# Altium schematic sheet Turtlelogger.SchDoc
size 299 x 100 mm
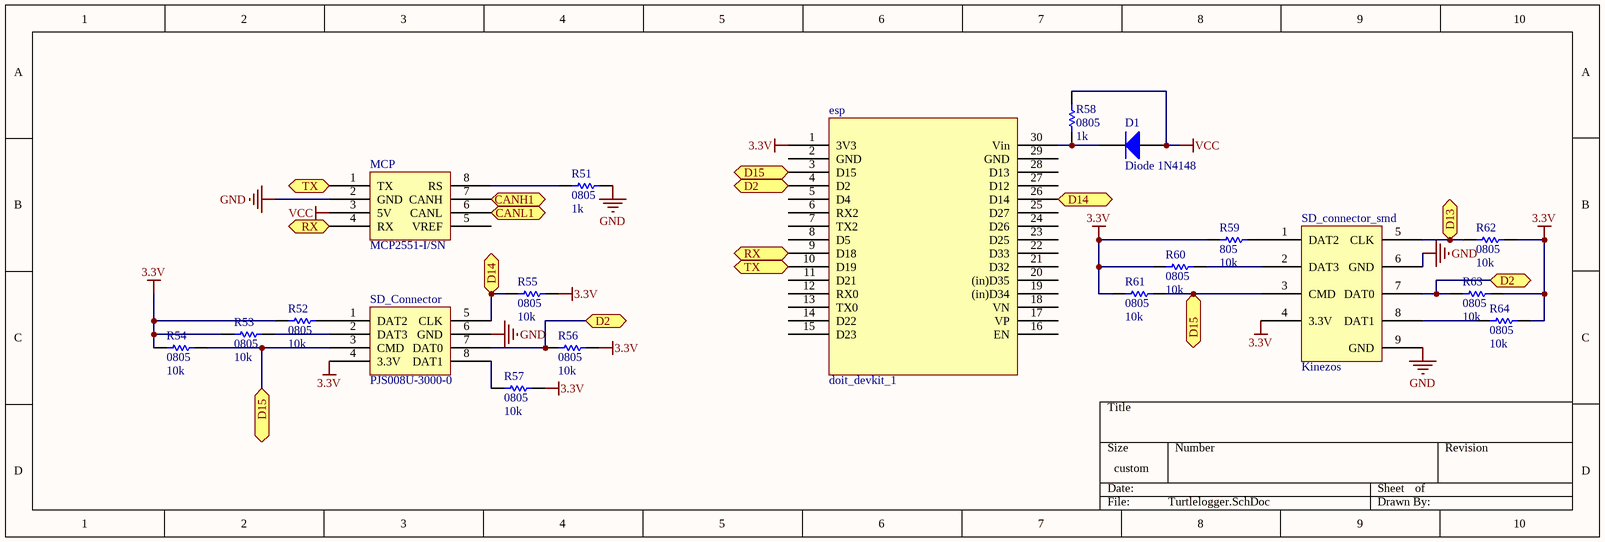
[diagram p0: Turtlelogger.SchDoc]

## Parts
D1  Diode 1N4148  [DO-35]
esp  doit_devkit_1  [PCBComponent_1]
MCP  MCP2551-I/SN  [SOIC127P600X175-8N]
R51  0805  value 1k  [RESC2012X06N]
R52  0805  value 10k  [RESC2012X06N]
R53  0805  value 10k  [RESC2012X06N]
R54  0805  value 10k  [RESC2012X06N]
R55  0805  value 10k  [RESC2012X06N]
R56  0805  value 10k  [RESC2012X06N]
R57  0805  value 10k  [RESC2012X06N]
R58  0805  value 1k  [RESC2012X06N]
R59  805  value 10k  [RESC2012X06N]
R60  0805  value 10k  [RESC2012X06N]
R61  0805  value 10k  [RESC2012X06N]
R62  0805  value 10k  [RESC2012X06N]
R63  0805  value 10k  [RESC2012X06N]
R64  0805  value 10k  [RESC2012X06N]
SD_Connector  PJS008U-3000-0  [PCBComponent_1]
SD_connector_smd  Kinezos  [PCBComponent_1]

## Ports
CANH1, CANL1, D2, D13, D14, D15, RX, TX

## Nets
3.3V: esp.1(3V3) R52.2 R53.2 R54.2 R55.1 R56.1 R57.1 R59.2 R60.2 R61.2 R62.1 R63.1 R64.1 SD_Connector.4(3.3V) SD_connector_smd.4(3.3V)
GND: MCP.2(GND) R51.1 SD_Connector.6(GND) SD_connector_smd.6(GND) SD_connector_smd.9(GND)
VCC: D1.1(A) MCP.3(5V) R58.1
CANH1: MCP.7(CANH) ; port CANH1
CANL1: MCP.6(CANL) ; port CANL1
D2: esp.4(D2) R56.2 R63.2 SD_Connector.7(DAT0) SD_connector_smd.7(DAT0) ; port D2
D13: R62.2 SD_connector_smd.5(CLK) ; port D13
D14: esp.26(D14) R55.2 SD_Connector.5(CLK) ; port D14
D15: esp.3(D15) R54.1 R61.1 SD_Connector.3(CMD) SD_connector_smd.3(CMD) ; port D15
RX: esp.9(D18) MCP.4(RX) ; port RX
TX: esp.10(D19) MCP.1(TX) ; port TX
NetD1_2: D1.2(K) esp.30(Vin) R58.2
NetMCP_8: MCP.8(RS) R51.2
NetR52_1: R52.1 SD_Connector.1(DAT2)
NetR53_1: R53.1 SD_Connector.2(DAT3)
NetR57_2: R57.2 SD_Connector.8(DAT1)
NetR59_1: R59.1 SD_connector_smd.1(DAT2)
NetR60_1: R60.1 SD_connector_smd.2(DAT3)
NetR64_2: R64.2 SD_connector_smd.8(DAT1)

Not connected (* = marked no-connect by the designer): esp 2(GND) 5(D4) 6(RX2) 7(TX2) 8(D5) 11(D21) 12(RX0) 13(TX0) 14(D22) 15(D23) 16(EN) 17(VP) 18(VN) 19((in)D34) 20((in)D35) 21(D32) 22(D33) 23(D25) 24(D26) 25(D27) 27(D12) 28(D13) 29(GND); MCP 5(VREF)

## Library data of the parts
D1 = Diode 1N4148: High Conductance Fast Diode; Published: 8-Jun-2000; LatestRevisionDate: 17-Jul-2002; LatestRevisionNote: Re-released for DXP Platform.; DatasheetVersion: 1997; PackageReference: DO-35; Publisher: Altium Limited; PackageDescription: Diode, Axial; Body 3.8 x 1.9 mm (LxDia. max), Lead Dia. 0.53 mm (max); Code_JEDEC: DO-204-AH; ComponentLink1Description: Manufacturer Link; ComponentLink1URL: http://www.fairchildsemi.com/; ComponentLink2Description: Datasheet; ComponentLink2URL: http://www.fairchildsemi.com/ds/1N%2F1N4148.pdf
esp = Component_1
MCP = Component_1: CAN Interface IC Hi Spd CAN Transceiv
R51-R64 = ERJ6RB: Precision Thick Film Chip Resistor, 10 Ohm to 1M Ohm Range, 1% and 0.5% Tolerance, 0805 Size, 0.1 W; Published: 17-Dec-2003; LatestRevisionDate: 19-Mar-2004; LatestRevisionNote: Silkscreen size reduced.; PackageDocument: Mar-2003; PackageReference: 6-0805; Publisher: Altium Limited; Code_IPC: 2012 [0805]; ComponentLink1Description: Manufacturer Link; ComponentLink1URL: http://www.panasonic.com/industrial/components/resistive_products.htm; ComponentLink2Description: Datasheet; ComponentLink2URL: http://www.panasonic.com/industrial/components/pdf/AOA0000CE2.pdf
SD_Connector = Component_1: Memory Card Connectors MicroSD Card Conn Ver Dip Mnt Manual
SD_connector_smd = Component_1: SD smd connector